# EAGLE design snullv3 (EAGLE 7.2.0)
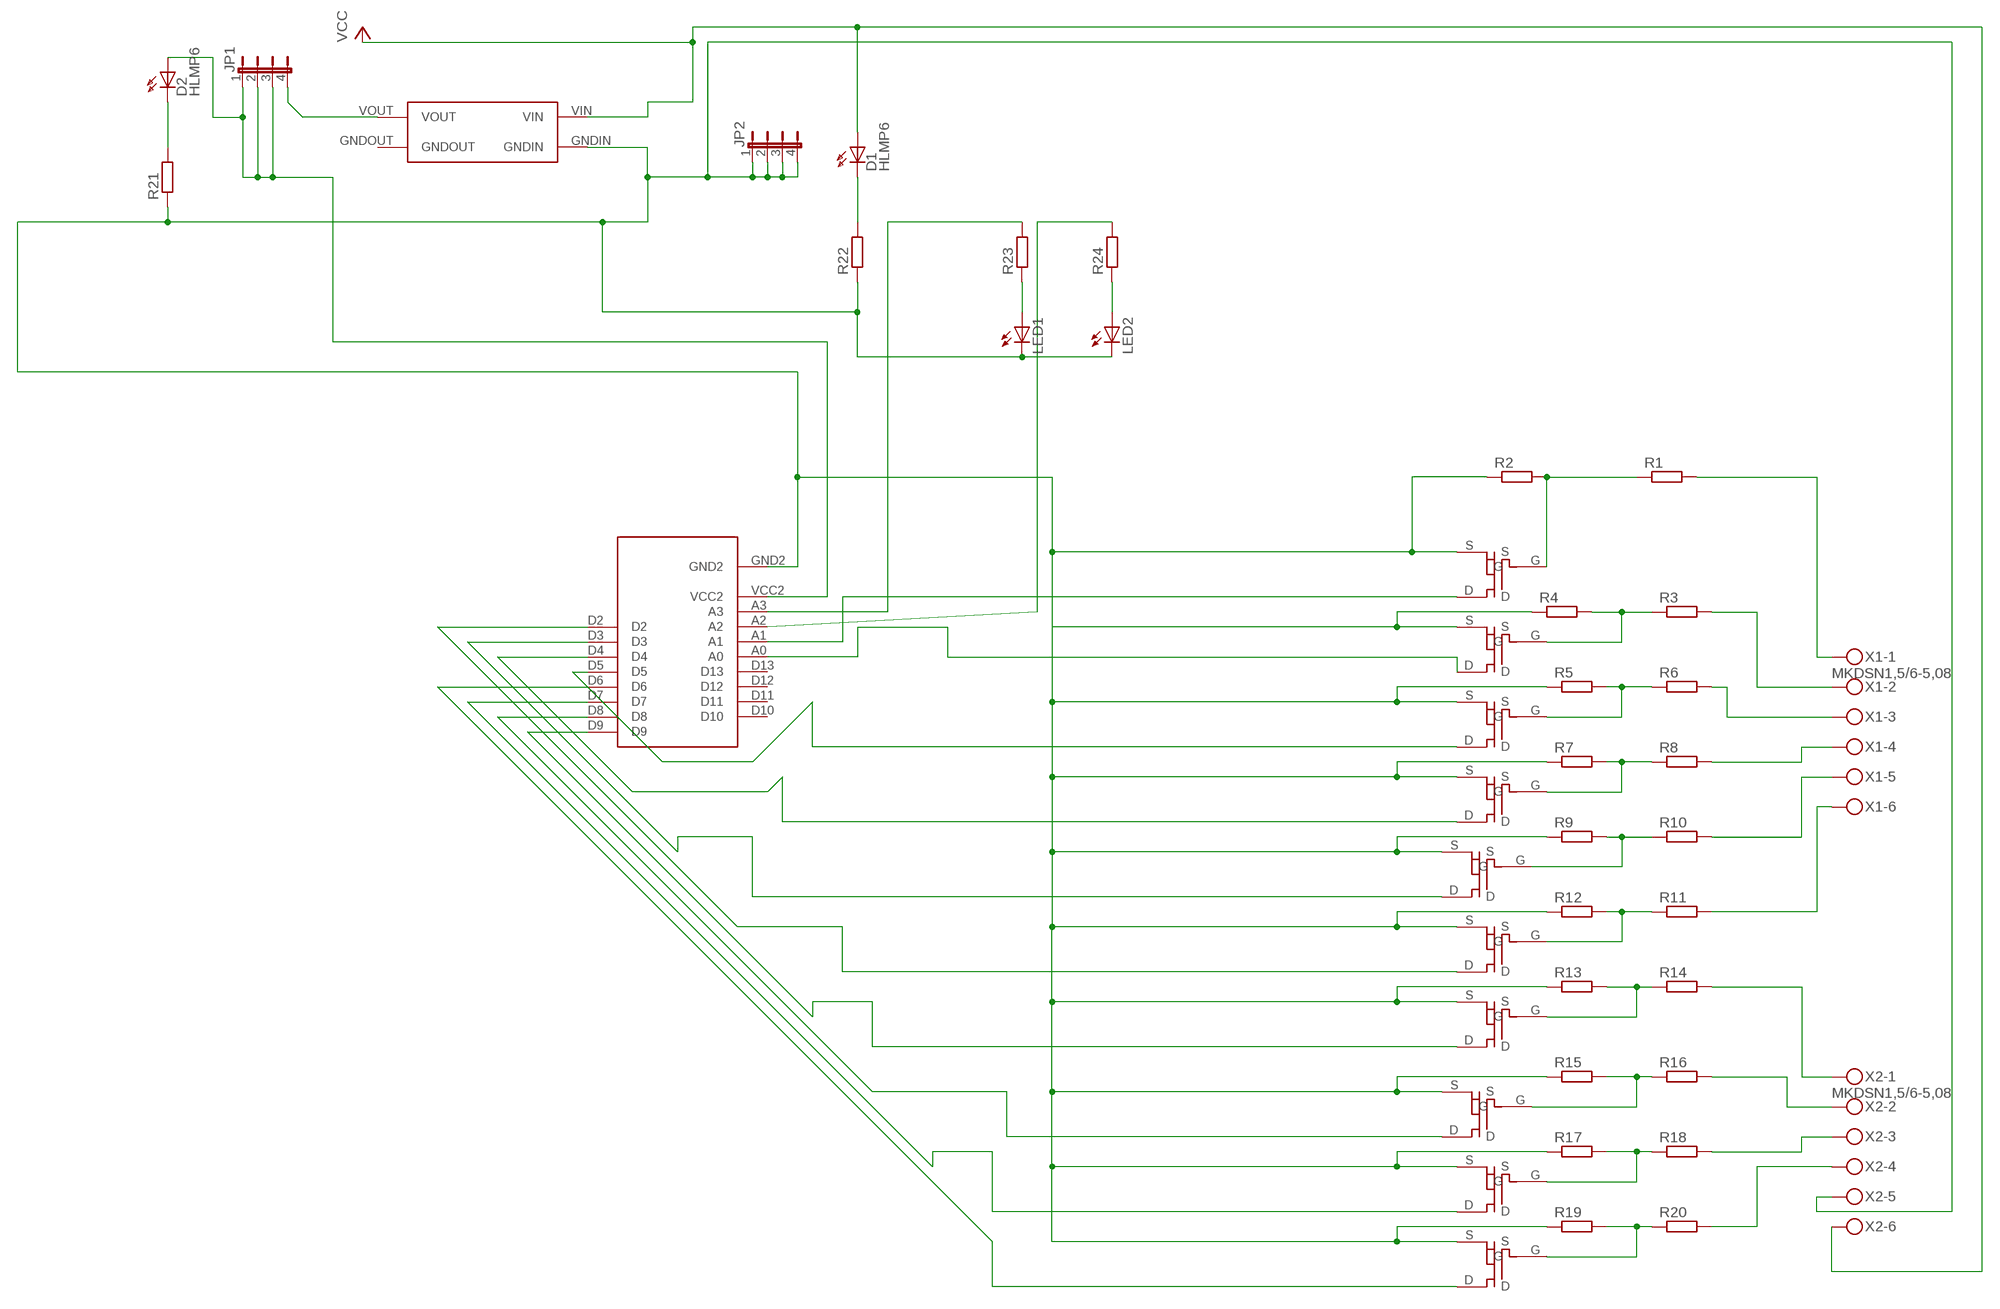
[diagram p0: schematic, sheet 1]

## Parts
D1  HLMP6  [HLMP6]
D2  HLMP6  [HLMP6]
JP1  JP4E  [JP4]
JP2  JP4E  [JP4]
LED1  LEDCHIP-LED0805  [CHIP-LED0805]
LED2  LEDCHIP-LED0805  [CHIP-LED0805]
R1  R-EU_R0805  [R0805]
R2  R-EU_R0805  [R0805]
R3  R-EU_R0805  [R0805]
R4  R-EU_R0805  [R0805]
R5  R-EU_R0805  [R0805]
R6  R-EU_R0805  [R0805]
R7  R-EU_R0805  [R0805]
R8  R-EU_R0805  [R0805]
R9  R-EU_R0805  [R0805]
R10  R-EU_R0805  [R0805]
R11  R-EU_R0805  [R0805]
R12  R-EU_R0805  [R0805]
R13  R-EU_R0805  [R0805]
R14  R-EU_R0805  [R0805]
R15  R-EU_R0805  [R0805]
R16  R-EU_R0805  [R0805]
R17  R-EU_R0805  [R0805]
R18  R-EU_R0805  [R0805]
R19  R-EU_R0805  [R0805]
R20  R-EU_R0805  [R0805]
R21  R-EU_R0805  [R0805]
R22  R-EU_R0805  [R0805]
R23  R-EU_R0805  [R0805]
R24  R-EU_R0805  [R0805]
U$1  ARDUINOPROMINIREDUCED  [ARDUINOPROMINIREDUCED]
U$2  VREGMODULE  [VREGMODULE]
U$3  MOSFET-TO236  [MOSFET-TO236]
U$4  MOSFET-TO236  [MOSFET-TO236]
U$5  MOSFET-TO236  [MOSFET-TO236]
U$6  MOSFET-TO236  [MOSFET-TO236]
U$7  MOSFET-TO236  [MOSFET-TO236]
U$8  MOSFET-TO236  [MOSFET-TO236]
U$9  MOSFET-TO236  [MOSFET-TO236]
U$10  MOSFET-TO236  [MOSFET-TO236]
U$11  MOSFET-TO236  [MOSFET-TO236]
U$12  MOSFET-TO236  [MOSFET-TO236]
X1  MKDSN1,5/6-5,08  [MKDSN1,5/6-5,08]
X2  MKDSN1,5/6-5,08  [MKDSN1,5/6-5,08]

## Nets
N$1: R13.2 R14.1 U$9.G
N$2: R6.2 X1.3
N$3: R14.2 X2.1
N$4: R16.2 X2.2
N$5: R18.2 X2.3
N$6: R1.2 X1.1
N$7: R8.2 X1.4
N$8: U$1.A0 U$4.D
N$9: R9.2 R10.1 U$7.G
N$10: U$1.A1 U$3.D
N$11: R3.2 X1.2
N$12: D2.A JP1.1 JP1.2 JP1.3 U$1.VCC2
N$13: U$1.D9 U$9.D
N$14: U$1.D4 U$6.D
N$15: U$1.D3 U$7.D
N$16: U$1.D8 U$10.D
N$17: U$1.D2 U$8.D
N$18: U$1.D5 U$5.D
N$19: JP1.4 U$2.VOUT
N$20: R10.2 X1.5
N$21: U$1.D6 U$12.D
N$22: R1.1 R2.2 U$3.G
N$23: U$4.G
N$24: U$1.D7 U$11.D
N$25: R5.2 R6.1 U$5.G
N$26: R3.1 R4.2
N$27: R7.2 R8.1 U$6.G
N$28: R11.2 X1.6
N$29: R11.1 R12.2 U$8.G
N$30: R20.2 X2.4
N$31: R19.2 R20.1 U$12.G
N$32: R17.2 R18.1 U$11.G
N$33: R15.2 R16.1 U$10.G
N$34: D2.K R21.2
N$35: D1.K R22.2
N$36: LED1.A R23.1
N$37: LED2.A R24.1
N$38: R23.2 U$1.A3
N$39: R24.2 U$1.A2
VCC: D1.A U$2.VIN X2.6
VDD: JP2.1 JP2.2 JP2.3 JP2.4 LED1.C LED2.C R2.1 R4.1 R5.1 R7.1 R9.1 R12.1 R13.1 R15.1 R17.1 R19.1 R21.1 R22.1 U$1.GND2 U$2.GNDIN U$3.S U$4.S U$5.S U$6.S U$7.S U$8.S U$9.S U$10.S U$11.S U$12.S X2.5
Unconnected: U$1.D10 U$1.D11 U$1.D12 U$1.D13 U$2.GNDOUT

## Library data of the parts
D1 D2 = display-hp:HLMP6: LED 2mm horizontal; MF: AGILENT TECHNOLOGIES; MPN: HLMP-6500; OC_FARNELL: 1652490; OC_NEWARK: 40K0088
JP1 JP2 = jumper:JP4E: JUMPER
LED1 LED2 = led:LED: LED OSRAM: - CHIPLED LG R971, LG N971, LY N971, LG Q971, LY Q971, LO R971, LY R971 LH N974, LH R974 LS Q976, LO Q976, LY Q976 LO Q996 - Hyper CHIPLED LW Q18S LB Q993, LB Q99A, LB R99A - SideLED LS A670, LO A670, LY A670, LG A670, LP A670 LB A673, LV A673, LT A673, LW A673 LH A674 LY A675 LS A676, LA A676, LO A676, LY A676, LW A676 LS A679, LY A679, LG A679 - Hyper Micro SIDELED® LS Y876, LA Y876, LO Y876, LY Y876 LT Y87S - SmartLED LW L88C, LW L88S LB L89C, LB L89S, LG L890 LS L89K, LO L89K, LY L89K LS L896, LA L896, LO L896, LY L896 - TOPLED LS T670, LO T670, LY T670, LG T670, LP T670 LSG T670, LSP T670, LSY T670, LOP T670, LYG T670 LG T671, LOG T671, LSG T671 LB T673, LV T673, LT T673, LW T673 LH T674 LS T676, LA T676, LO T676, LY T676, LB T676, LH T676, LSB T676, LW T676 LB T67C, LV T67C, LT T67C, LS T67K, LO T67K, LY T67K, LW E67C LS E67B, LA E67B, LO E67B, LY E67B, LB E67C, LV E67C, LT E67C LW T67C LS T679, LY T679, LG T679 LS T770, LO T770, LY T770, LG T770, LP T770 LB T773, LV T773, LT T773, LW T773 LH T774 LS E675, LA E675, LY E675, LS T675 LS T776, LA T776, LO T776, LY T776, LB T776 LHGB T686 LT T68C, LB T68C - Hyper Mini TOPLED® LB M676 - Mini TOPLED Santana® LG M470 LS M47K, LO M47K, LY M47K Source: http://www.osram.convergy.de LUXEON: - LUMILED® LXK2-PW12-R00, LXK2-PW12-S00, LXK2-PW14-U00, LXK2-PW14-V00 LXK2-PM12-R00, LXK2-PM12-S00, LXK2-PM14-U00 LXK2-PE12-Q00, LXK2-PE12-R00, LXK2-PE12-S00, LXK2-PE14-T00, LXK2-PE14-U00 LXK2-PB12-K00, LXK2-PB12-L00, LXK2-PB12-M00, LXK2-PB14-N00, LXK2-PB14-P00, LXK2-PB14-Q00 LXK2-PR12-L00, LXK2-PR12-M00, LXK2-PR14-Q00, LXK2-PR14-R00 LXK2-PD12-Q00, LXK2-PD12-R00, LXK2-PD12-S00 LXK2-PH12-R00, LXK2-PH12-S00 LXK2-PL12-P00, LXK2-PL12-Q00, LXK2-PL12-R00 Source: www.luxeon.com KINGBRIGHT: KA-3528ASYC Source: www.kingbright.com
R1-R24 = resistor:R-EU_: RESISTOR, European symbol
U$1 = snulllib:ARDUINOPROMINIREDUCED
U$2 = snulllib:VREGMODULE
U$3-U$12 = snulllib:MOSFET-TO236
X1 X2 = con-phoenix-508:MKDSN1,5/6-5,08: MKDSN 1,5/ 6-5,08 Printklemme Nennstrom: 13,5 A Nennspannung: 250 V Rastermaß: 5,08 mm Polzahl: 6 Anschlussart: Schraubanschluss Montage: Löten Anschlussrichtung Leiter/Platine: 0 ° Artikelnummer: 1729160 Source: http://eshop.phoenixcontact.com .. 1729160.pdf

## Board
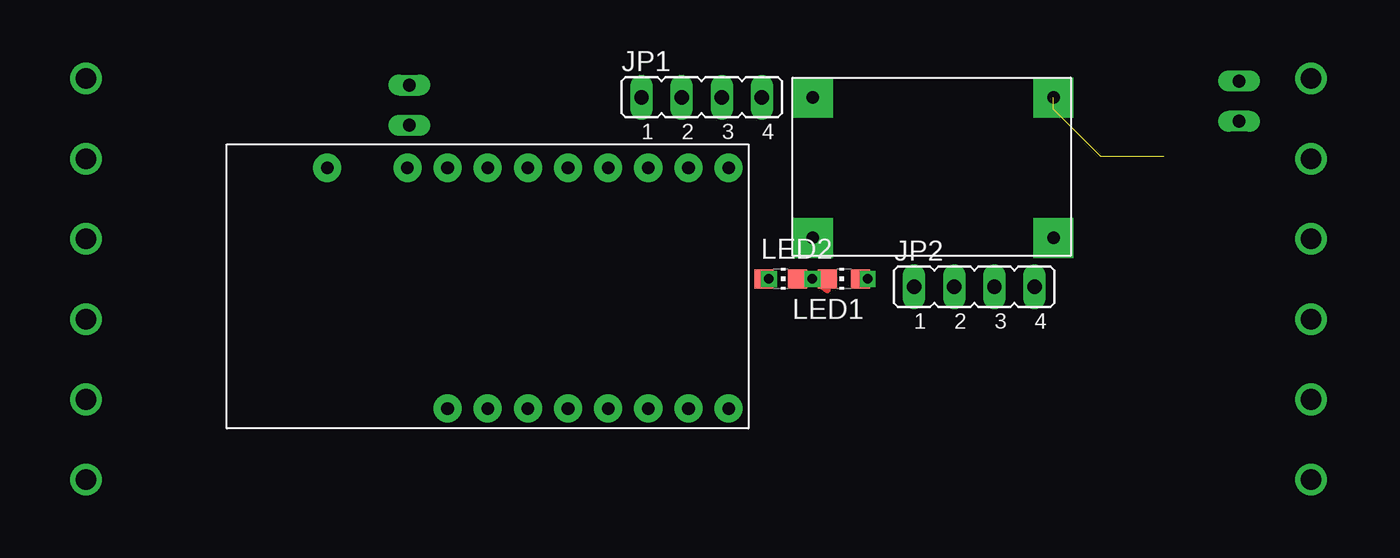
[diagram p1: board, top side]
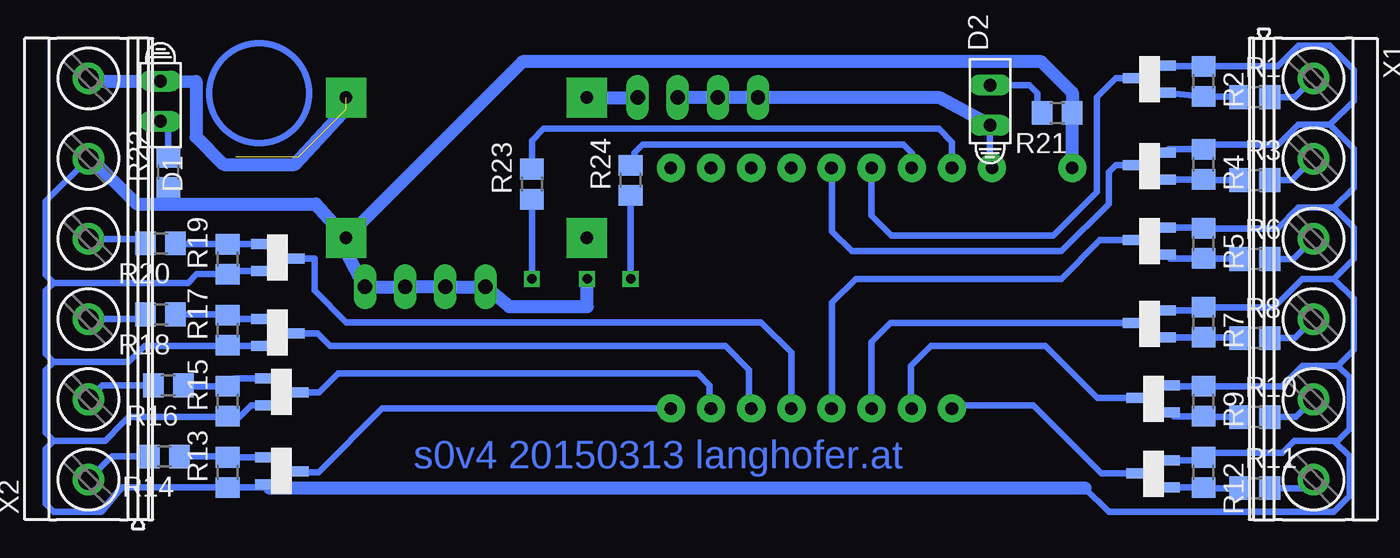
[diagram p2: board, bottom side, seen from below]

No outline drawn. Coordinates in mm, seen from the top.
Copper layers (1*16): Top 0.035mm / dielectric 1.5mm / Bottom 0.035mm
Design rules "default": minimum track width 10mil, minimum drill 24mil, track to track 8mil, track to pad 8mil, pad to pad 8mil, via to via 8mil, smd to smd 8mil, copper to edge 40mil, drill to drill 8mil, minimum pad ring 10mil, minimum via ring 8mil, stop-mask expansion 4mil, vias tented up to drill 0mil, thermal gap 10mil

### Footprints (pad centres in the part's own frame; a part is rotated, then mirrored left to right if it is on the bottom)
HLMP6 = drill 0.813 long: A -1.27,0; K 1.27,0
JP4 = drill 0.914 long: 1 -3.81,0; 2 -1.27,0; 3 1.27,0; 4 3.81,0
CHIP-LED0805 = smd 1.2 x 1.2: A 0,-1.05; C 0,1.05
R0805 = smd 1.3 x 1.5: 1 -0.95,0; 2 0.95,0
ARDUINOPROMINIREDUCED = drill 0.8 pad 1.778: A0 16.51,-21.59; A1 16.51,-19.05; A2 16.51,-16.51; A3 16.51,-13.97; D2 1.27,-13.97; D3 1.27,-16.51; D4 1.27,-19.05; D5 1.27,-21.59; D6 1.27,-24.13; D7 1.27,-26.67; D8 1.27,-29.21; D9 1.27,-31.75; D10 16.51,-31.75; D11 16.51,-29.21; D12 16.51,-26.67; D13 16.51,-24.13; GND2 16.51,-6.35; VCC2 16.51,-11.43
VREGMODULE = drill 0.8 pad 2.54 square: GNDIN 16.51,-10.16; GNDOUT 1.27,-10.16; VIN 16.51,-1.27; VOUT 1.27,-1.27
MOSFET-TO236 = smd 0.635 x 1.27: D 1.5,1.73; G 0.6,-0.37; S 2.3,-0.37
MKDSN1,5/6-5,08 = drill 1.3 pad 2: 1 -12.7,0.025; 2 -7.62,0.025; 3 -2.54,0.025; 4 2.54,0.025; 5 7.62,0.025; 6 12.7,0.025

### Placement (x,y rotation side)
D1  76.75,26.5 270 bottom
D2  24.25,26.25 90 bottom
JP1  42.75,26.75 0 top
JP2  60,14.75 0 top
LED1  51.75,15.25 90 top
LED2  47.75,15.25 270 top
R1  7.5,26.75 0 bottom
R2  10.75,27.75 270 bottom
R3  7.5,21.5 0 bottom
R4  10.75,22.5 270 bottom
R5  10.75,17.5 270 bottom
R6  7.5,16.5 0 bottom
R7  10.75,12.5 270 bottom
R8  7.5,11.5 0 bottom
R9  10.75,7.5 270 bottom
R10  7.5,6.5 0 bottom
R11  7.5,2 0 bottom
R12  10.75,3 270 bottom
R13  72.5,3 90 bottom
R14  76.5,4 180 bottom
R15  72.5,7.5 90 bottom
R16  76.25,8.5 180 bottom
R17  72.5,12 90 bottom
R18  76.75,13 180 bottom
R19  72.5,16.5 90 bottom
R20  76.75,17.5 180 bottom
R21  20,25.75 180 bottom
R22  76.25,22 90 bottom
R23  53.25,21.25 90 bottom
R24  47,21.5 90 bottom
U$1  12.7,5.77 90 top
U$2  48.5,28 0 top
U$3  13.5,26.45 90 bottom
U$4  13.5,20.95 90 bottom
U$5  13.5,16.2 90 bottom
U$6  13.5,10.95 90 bottom
U$7  13.25,6.2 90 bottom
U$8  13.25,1.45 90 bottom
U$9  69.75,4.55 270 bottom
U$10  69.75,9.55 270 bottom
U$11  70,13.3 270 bottom
U$12  70,18.05 270 bottom
X1  3.81,15.24 270 bottom
X2  81.28,15.24 90 bottom

### Tracks (layer width: path | path; a pad name or v marks a point on that pad's centre or on a via)
N$1
  Bottom 0.406: R14.1 72.55,4 R13.2 U$9.G
N$2
  Bottom 0.406: R6.2 5.07,16.5 X1.3
N$3
  Bottom 0.406: R14.2 79.84,4 X2.1
N$4
  Bottom 0.406: R16.2 80.42,8.5 X2.2
N$5
  Bottom 0.406: X2.3 78,12.7 R18.2
N$6
  Bottom 0.406: R1.2 4.97,26.75 X1.1
N$7
  Bottom 0.406: R8.2 4.99,11.5 X1.4
N$8
  Bottom 0.406: U$4.D 16.3,22.45 16.75,22 16.75,20 19.75,17 33,17 34.25,18.25 34.25,22.24 U$1.A0
N$9
  Bottom 0.406: U$7.G 12.63,6.55 R9.2 10.7,6.5 R10.1
N$10
  Bottom 0.406: U$3.D 16.3,27.95 17.5,26.75 17.5,20.75 20.25,18 30.5,18 31.75,19.25 U$1.A1
N$11
  Bottom 0.406: 4,22.86 X1.2 5.14,21.5 R3.2
N$12  (via drill 0.6)
  Top 0.406: v24.25,25 24.27,25 D2.A
  Bottom 0.406: D2.A 24.25,22.4 U$1.VCC2
  Bottom 0.813: JP1.3 JP1.2 JP1.1 27.5,26.75 v24.25,25
N$13
  Bottom 0.406: U$1.D9 62.71,7.04 66.75,3 67.97,3 U$9.D
N$14
  Bottom 0.406: U$6.D 30.55,12.45 31.75,11.25 U$1.D4
N$15
  Bottom 0.406: U$7.D 17.45,7.7 20.75,11 28,11 29.25,9.75 29.25,7.08 U$1.D3
N$16
  Bottom 0.406: U$10.D 66.7,8.05 65.5,9.25 42.75,9.25 42,8.5 42,7.13 U$1.D8
N$17
  Bottom 0.406: U$8.D 17.2,2.95 21.5,7.25 26.46,7.25 U$1.D2
N$18
  Bottom 0.406: U$5.D 17.3,17.7 19.75,15.25 32.75,15.25 34.25,13.75 34.25,7.08 U$1.D5
N$19
  Bottom 0.406: 46.56,26.73 JP1.4
  Bottom 0.813: U$2.VOUT 46.56,26.73
N$20
  Bottom 0.406: R10.2 4.91,6.5 X1.5
N$21
  Bottom 0.406: U$12.D 67,16.55 67,14.5 65,12.5 38.75,12.5 36.83,10.58 U$1.D6
N$22
  Bottom 0.406: U$3.G R2.2 8.5,26.8 R1.1
N$24
  Bottom 0.406: U$11.D 66.8,11.8 66,11 41,11 39.5,9.5 39.5,7.17 U$1.D7
N$25
  Bottom 0.406: R6.1 8.5,16.55 R5.2 12.88,16.55 U$5.G
N$26
  Bottom 0.406: 13,21.5 12.95,21.55 R4.2 10.7,21.5 R3.1
N$27
  Bottom 0.406: R8.1 8.5,11.55 R7.2 U$6.G
N$28
  Bottom 0.406: R11.2 4.33,2 X1.6
N$29
  Bottom 0.406: U$8.G R12.2 10.7,2 R11.1
N$30
  Bottom 0.406: X2.4 77.98,17.78 R20.2
N$31
  Bottom 0.406: R20.1 75.75,17.45 R19.2 U$12.G
N$32
  Bottom 0.406: R18.1 72.55,13 R17.2 72.25,12.7 U$11.G
N$33
  Bottom 0.406: R16.1 75.25,8.45 R15.2 72,8.95 U$10.G
N$34  (via drill 0.6)
  Top 0.406: v24.25,27.5 24.23,27.5 D2.K
  Bottom 0.406: R21.2 21.25,26.05 21.25,27 21.77,27.52 22.73,27.52 v24.25,27.5
N$35
  Bottom 0.406: R22.2 76.25,24.73 D1.K
N$36  (via drill 0.6)
  Top 0.406: v53.25,15.25 53.25,14.95 LED1.A
  Bottom 0.406: R23.1 v53.25,15.25
N$37  (via drill 0.6)
  Top 0.406: v47,15.25 46.75,15.3 LED2.A
  Bottom 0.406: R24.1 v47,15.25
N$38
  Bottom 0.406: U$1.A3 26.67,23.92 27.5,24.75 52.5,24.75 53.25,24 R23.2
N$39
  Bottom 0.406: U$1.A2 29.21,23.21 29.75,23.75 46.25,23.75 46.75,23.25 46.75,22.7 R24.2
VCC  (3 unrouted)
  Bottom 0.406: X2.6 81.14,27.77 | D1.A 76.52,27.77 | 65.25,26.49 U$2.VIN
  Bottom 0.813: 81.14,27.77 D1.A | 76.52,27.77 74.5,27.75 74.5,24.25 72.75,22.5 68.25,22.5 65.25,25.75 65.25,26.49
VDD  (via drill 0.6)
  Top 0.406: LED2.C LED1.C 50.7,14.55 v49.75,15.25
  Bottom 0.406: 83.5,15 84,14.5 84,10.5 83.5,10 | 83.5,10 78.75,10 77.75,11 72.55,11 R17.1 72.45,11 U$11.S | 83.5,5 80.25,5 79.13,6.12 78.88,6.38 78.75,6.5 72.45,6.5 | 83.5,5 84,5.5 84,9.5 83.5,10 | 83.5,5 84,4.5 84,1 83.5,0.5 80.5,0.5 79.21,2.04 79.2,2.05 R13.1 | 83.5,15 84,15.5 84,20.16 X2.5 81.25,22.91 80.75,22.5 | 65.31,17.54 U$2.GNDIN | U$3.S 12.83,28.7 R2.1 6.05,28.7 4.75,30 2.75,30 1.25,28.5 1.25,26.5 2.75,25 | U$4.S 12.93,23.45 R4.1 10.45,23.75 6,23.75 4.75,25 2.75,25 | U$5.S 10.8,18.5 R5.1 6.05,18.45 4.75,19.75 2.5,19.75 | U$6.S 10.95,13.25 R7.1 6.3,13.45 4.5,15.25 2.5,15.25 | U$7.S 12.83,8.45 R9.1 5.8,8.45 4.5,9.75 2.25,9.75 | U$8.S 10.95,3.75 R12.1 10.45,4.25 5.75,4.25 5,5 2.5,5 | U$10.S 71,7.25 71.75,6.5 72.45,6.5 | 72.45,6.5 R15.1 | U$12.S 72.3,15.75 R19.1 74.45,15.55 75,15 83.5,15 | 63.85,14.79 JP2.4 | 72.45,2 R13.1 | 18.25,2 16.75,0.5 2.5,0.5 1.5,1.5 1.5,4 2.5,5 | 69.87,2 U$9.S 70.32,2.05 R13.1 | 2.25,9.75 1.5,9 1.5,5.75 2.25,5 2.5,5 | 2.5,15.25 1.25,14 1.25,10.75 2.25,9.75 | 2.5,19.75 1.25,21 1.25,23.5 2.75,25 | 2.5,15.25 1.25,16.5 1.25,18.5 2.5,19.75 | R22.1 76.25,20
  Bottom 0.813: JP2.4 JP2.3 JP2.2 JP2.1 54.69,13.5 49.75,13.5 v49.75,15.25 | 65.31,17.54 63.85,14.79 | 18.25,2 69.87,2 | 80.75,22.5 78.25,20 76.25,20 66.92,20 U$2.GNDIN 53.85,29 21,29 19.05,27.05 R21.1 U$1.GND2
(copper drawn outside any net)
  shapes: Bottom circle x1

### Text on the board
Bottom: s0v4 20150313 langhofer.at